# Altium schematic sheet RS485.SchDoc
size A; SheetNumber: 3; SheetTotal: 9
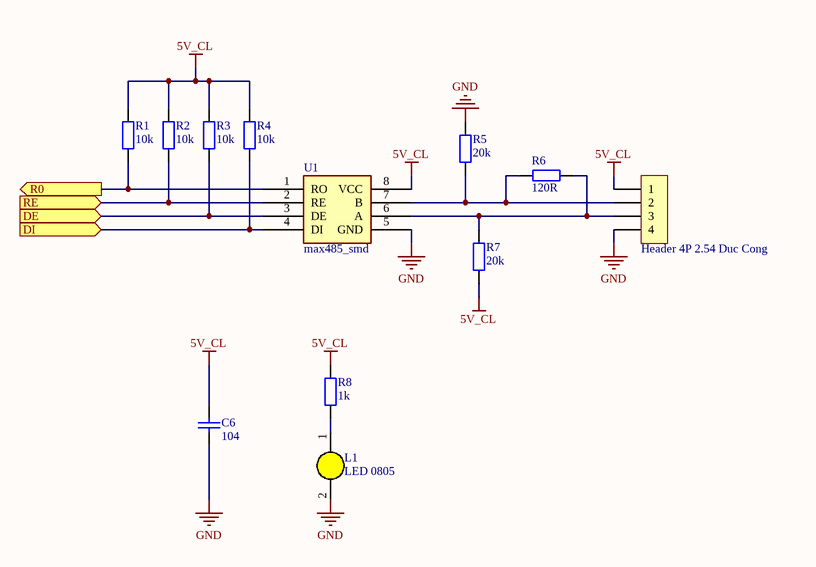
[diagram p0: RS485.SchDoc]

## Parts
C6  104  [tu 0805]
H1  Header 4P 2.54 Duc Cong  [Header 4P DC 2.54]
L1  LED 0805  [LED-0805-Yellow]
R1  10k  [tro smd 0805]
R2  10k  [tro smd 0805]
R3  10k  [tro smd 0805]
R4  10k  [tro smd 0805]
R5  20k  [tro smd 0805]
R6  120R  [tro smd 0805]
R7  20k  [tro smd 0805]
R8  1k  [tro smd 0805]
U1  max485_smd  [DIP8/W0.3]

## Ports
DE (in), DI (in), R0 (out), RE (in)

## Nets
5V_CL: C6.2 H1.1 R1.2 R2.2 R3.2 R4.2 R7.2 R8.2 U1.8(VCC)
GND: C6.1 H1.4 L1.2(K) R5.2 U1.5(GND)
DE: R3.1 U1.3(DE) ; port DE
DI: R4.1 U1.4(DI) ; port DI
R0: R1.1 U1.1(RO) ; port R0
RE: R2.1 U1.2(RE) ; port RE
NetH1_2: H1.2 R5.1 R6.1 U1.7(B)
NetH1_3: H1.3 R6.2 R7.1 U1.6(A)
NetL1_1: L1.1(A) R8.1

## Library data of the parts
C6 = Tu 0805 104 50V 10%: Dán; Don_Vi: Con; So_Chan: 2; Ten_Linh_Kien: Tụ 0805 104-100nF 10% 50V; Ma_Hang: MH004551; Chung_Loai: Dán; Kieu_Chan: *
H1 = Header 4P 2.54 Duc Cong: Cắm; Ten_Linh_Kien: Header 4P XH2.54-4P Đực Cong; Don_Vi: Con; Ma_Hang: MH001310; Chung_Loai: Cắm
L1 = LED 0805 Vang: Dán; Don_Vi: Con; Ma_Hang: MH002329; Ten_Linh_Kien: LED 0805 Màu Vàng ( Yellow); Ghi_Chu: *; Kieu_Chan: *; Chung_Loai: Dán
R1-R4 = Tro 0805 1% 10k: Dán; Don_Vi: Con; So_Chan: 2; Ten_Linh_Kien: Trở 0805 1% 10k; Ma_Hang: MH005473; Chung_Loai: Dán; Kieu_Chan: *
R5 R7 = Tro 0805 5% 20k: Dán; Don_Vi: Con; So_Chan: 2; Ten_Linh_Kien: Trở 0805 5% 20k; Ma_Hang: MH005247; Chung_Loai: Dán; Kieu_Chan: *
R6 = Tro 0805 5% 120R: Dán; Don_Vi: Con; So_Chan: 2; Ten_Linh_Kien: Trở 0805 5% 120R; Ma_Hang: MH005253; Chung_Loai: Dán; Kieu_Chan: *
R8 = Tro 0805 1% 1k: Dán; Don_Vi: Con; So_Chan: 2; Ten_Linh_Kien: Trở 0805 1% 1k; Ma_Hang: MH005468; Chung_Loai: Dán; Kieu_Chan: *